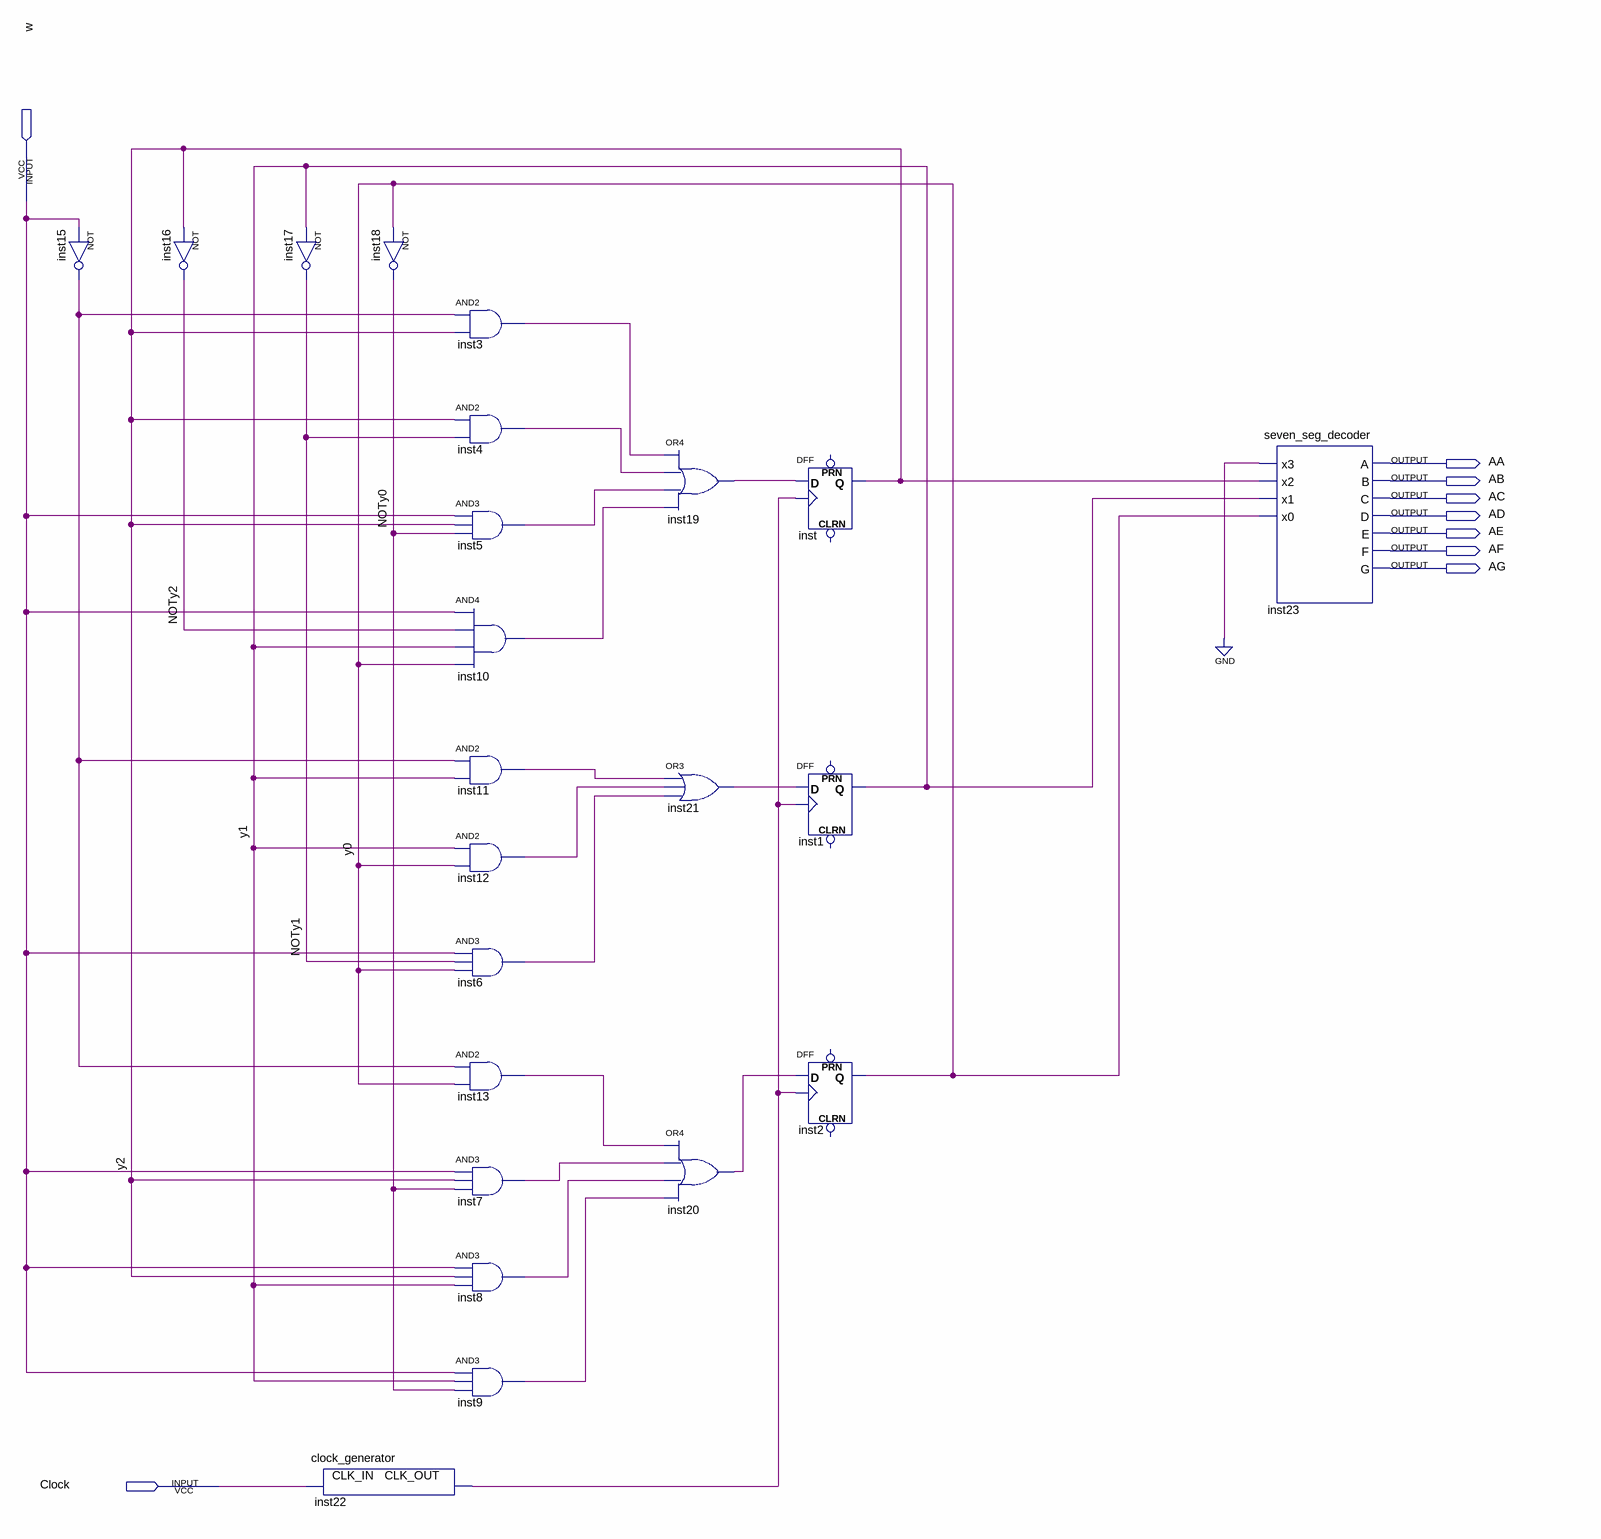
[diagram p0: schematic sheet]
// Quartus schematic Up_counter1_3b.bdf as structural Verilog: 23 symbols, 9 pins
module Up_counter1_3b (
  input  w,
  input  Clock,
  output AA,
  output AB,
  output AC,
  output AD,
  output AE,
  output AF,
  output AG
);

  wire inst3_out, inst4_out, inst5_out, inst6_out, inst7_out, inst8_out, inst9_out, inst10_out, inst11_out,
       inst12_out, inst13_out, inst15_out, inst19_out, inst20_out, inst21_out, inst22_clk_out, NOTy0, NOTy1,
       NOTy2, y0, y1, y2;

  not inst15 (inst15_out, w);
  not inst16 (NOTy2, y2);
  not inst17 (NOTy1, y1);
  clock_generator inst22 (.CLK_IN(Clock), .CLK_OUT(inst22_clk_out));
  not inst18 (NOTy0, y0);
  and inst3 (inst3_out, inst15_out, y2);
  and inst4 (inst4_out, y2, NOTy1);
  and inst5 (inst5_out, w, y2, NOTy0);
  and inst10 (inst10_out, w, NOTy2, y1, y0);
  and inst11 (inst11_out, inst15_out, y1);
  and inst12 (inst12_out, y1, y0);
  and inst6 (inst6_out, w, NOTy1, y0);
  and inst13 (inst13_out, inst15_out, y0);
  and inst7 (inst7_out, w, y2, NOTy0);
  and inst8 (inst8_out, w, y2, y1);
  and inst9 (inst9_out, w, y1, NOTy0);
  or inst19 (inst19_out, inst3_out, inst4_out, inst5_out, inst10_out);
  or inst21 (inst21_out, inst11_out, inst12_out, inst6_out);
  or inst20 (inst20_out, inst13_out, inst7_out, inst8_out, inst9_out);
  DFF inst (.CLK(inst22_clk_out), .D(inst19_out), .Q(y2));  // open: CLRN, PRN
  DFF inst1 (.CLK(inst22_clk_out), .D(inst21_out), .Q(y1));  // open: CLRN, PRN
  DFF inst2 (.CLK(inst22_clk_out), .D(inst20_out), .Q(y0));  // open: CLRN, PRN
  seven_seg_decoder inst23 (
    .x3(1'b0), .x2(y2), .x1(y1), .x0(y0), .A(AA), .B(AB), .C(AC), .D(AD), .E(AE), .F(AF), .G(AG));
endmodule
